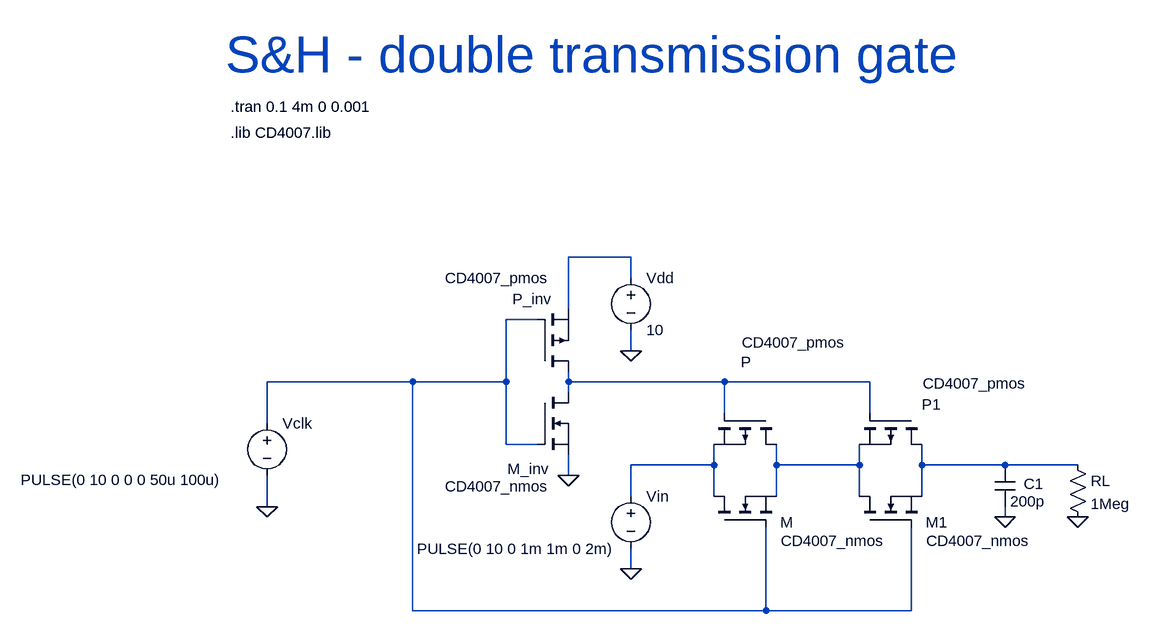
[diagram p0: schematic SampleAndHold_DoubleTrasmissionGate.asc]
SampleAndHold_DoubleTrasmissionGate.asc, the LTspice schematic file:
Version 4.1
SHEET 1 2276 680
WIRE -32 -160 -128 -160
WIRE -32 -128 -32 -160
WIRE -128 -80 -128 -160
WIRE -176 -64 -224 -64
WIRE -32 -16 -32 -48
WIRE -368 32 -592 32
WIRE -224 32 -224 -64
WIRE -224 32 -368 32
WIRE -128 32 -128 16
WIRE 112 32 -128 32
WIRE 336 32 112 32
WIRE -128 48 -128 32
WIRE 112 80 112 32
WIRE 336 80 336 32
WIRE -592 96 -592 32
WIRE -224 128 -224 32
WIRE -176 128 -224 128
WIRE 96 160 96 128
WIRE 96 160 -32 160
WIRE 192 160 192 128
WIRE 320 160 320 128
WIRE 320 160 192 160
WIRE 416 160 416 128
WIRE 544 160 416 160
WIRE 656 160 544 160
WIRE -128 176 -128 144
WIRE -32 208 -32 160
WIRE 96 208 96 160
WIRE 192 208 192 160
WIRE 320 208 320 160
WIRE 416 208 416 160
WIRE -592 224 -592 176
WIRE 544 240 544 224
WIRE -32 320 -32 288
WIRE -368 384 -368 32
WIRE 176 384 176 256
WIRE 176 384 -368 384
WIRE 400 384 400 256
WIRE 400 384 176 384
FLAG -32 320 0
FLAG -128 176 0
FLAG -592 224 0
FLAG -32 -16 0
FLAG 544 240 0
FLAG 656 240 0
SYMBOL nmos 96 256 R270
WINDOW 0 8 102 VRight 2
WINDOW 3 -21 103 VRight 2
SYMATTR InstName M
SYMATTR Value CD4007_nmos
SYMBOL pmos 192 80 R90
WINDOW 0 -79 39 VRight 2
WINDOW 3 -109 -108 VRight 2
SYMATTR InstName P
SYMATTR Value CD4007_pmos
SYMBOL pmos -176 16 M180
WINDOW 0 -38 112 Left 2
WINDOW 3 -142 144 Left 2
SYMATTR InstName P_inv
SYMATTR Value CD4007_pmos
SYMBOL nmos -176 48 R0
WINDOW 0 19 118 Right 2
WINDOW 3 19 145 Right 2
SYMATTR InstName M_inv
SYMATTR Value CD4007_nmos
SYMBOL voltage -32 192 R0
WINDOW 3 -329 97 Left 2
WINDOW 123 0 0 Left 0
WINDOW 39 0 0 Left 0
SYMATTR Value PULSE(0 10 0 1m 1m 0 2m)
SYMATTR InstName Vin
SYMBOL voltage -592 80 R0
WINDOW 3 -379 103 Left 2
WINDOW 123 0 0 Left 0
WINDOW 39 0 0 Left 0
SYMATTR Value PULSE(0 10 0 0 0 50u 100u)
SYMATTR InstName Vclk
SYMBOL voltage -32 -144 R0
WINDOW 123 0 0 Left 0
WINDOW 39 0 0 Left 0
SYMATTR InstName Vdd
SYMATTR Value 10
SYMBOL cap 528 160 R0
WINDOW 0 45 29 Left 2
SYMATTR InstName C1
SYMATTR Value 200p
SYMBOL nmos 320 256 R270
WINDOW 0 8 102 VRight 2
WINDOW 3 -21 103 VRight 2
SYMATTR InstName M1
SYMATTR Value CD4007_nmos
SYMBOL pmos 416 80 R90
WINDOW 0 -13 -29 VRight 2
WINDOW 3 -46 -163 VRight 2
SYMATTR InstName P1
SYMATTR Value CD4007_pmos
SYMBOL res 640 144 R0
SYMATTR InstName RL
SYMATTR Value 1Meg
TEXT -648 -352 Left 2 !.lib CD4007.lib
TEXT -648 -392 Left 2 !.tran 0.1 4m 0 0.001
TEXT -656 -472 Left 6 ;S&H - double transmission gate

The netlist it stands for:
* SampleAndHold_DoubleTrasmissionGate.asc
M N004 N002 N005 N005 CD4007_nmos
M§P N005 N003 N004 N004 CD4007_pmos
M§P_inv N003 N002 N001 N001 CD4007_pmos
M_inv N003 N002 0 0 CD4007_nmos
Vin N004 0 PULSE(0 10 0 1m 1m 0 2m)
Vclk N002 0 PULSE(0 10 0 0 0 50u 100u)
Vdd N001 0 10
C1 N006 0 200p
M1 N005 N002 N006 N006 CD4007_nmos
M§P1 N006 N003 N005 N005 CD4007_pmos
RL N006 0 1Meg
.model NMOS NMOS
.model PMOS PMOS
.lib standard.mos
.lib CD4007.lib
.tran 0.1 4m 0 0.001
* S&H - double transmission gate
.backanno
.end